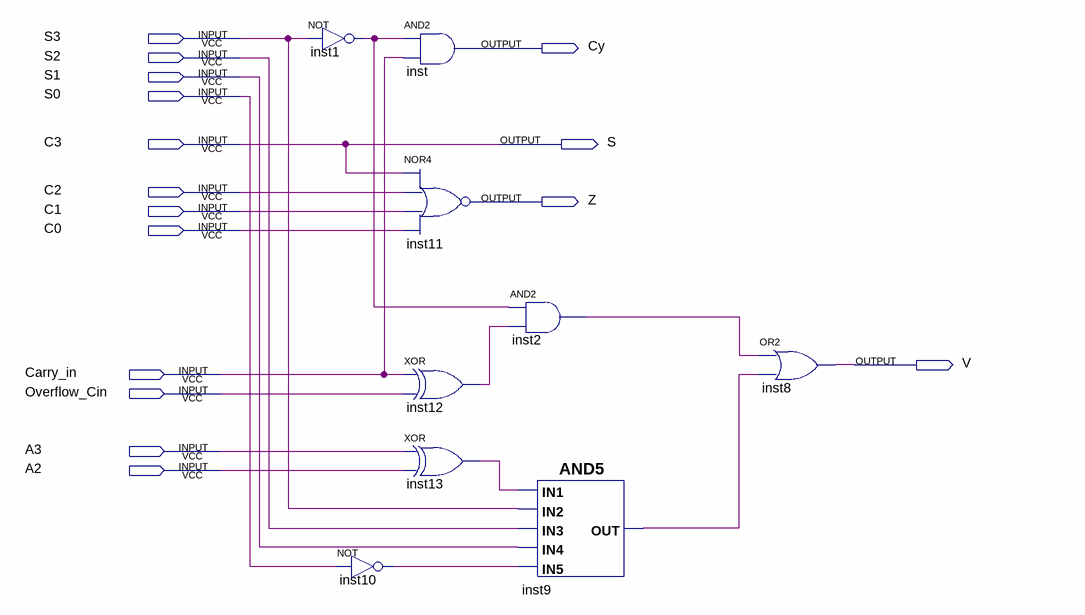
[diagram p0: schematic sheet]
// Quartus schematic state4bits.bdf as structural Verilog: 9 symbols, 16 pins
module state4bits (
  input  S3,
  input  S2,
  input  S1,
  input  S0,
  input  C3,
  input  C2,
  input  C1,
  input  C0,
  input  Carry_in,
  input  Overflow_Cin,
  input  A3,
  input  A2,
  output Cy,
  output S,
  output Z,
  output V
);

  wire inst1_out, inst2_out, inst9_out, inst10_out, inst12_out, inst13_out;

  not inst1 (inst1_out, S3);
  not inst10 (inst10_out, S0);
  and inst (Cy, inst1_out, Carry_in);
  nor inst11 (Z, C3, C2, C1, C0);
  xor inst12 (inst12_out, Carry_in, Overflow_Cin);
  xor inst13 (inst13_out, A3, A2);
  and inst2 (inst2_out, inst1_out, inst12_out);
  and inst9 (inst9_out, inst13_out, S3, S2, S1, inst10_out);
  or inst8 (V, inst2_out, inst9_out);

  assign S = C3;
endmodule
